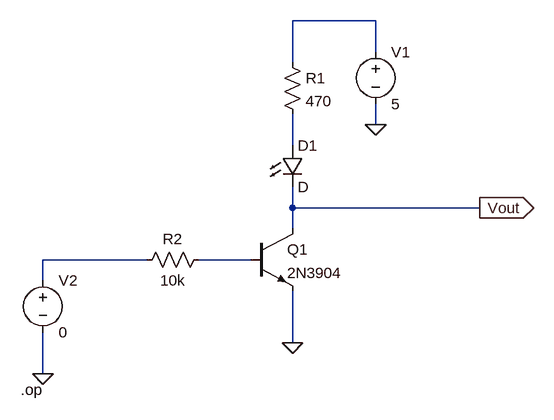
[diagram p0: schematic NotGateAnalog.asc]
NotGateAnalog.asc, the LTspice schematic file:
Version 4
SHEET 1 880 680
WIRE 304 -112 176 -112
WIRE 304 -64 304 -112
WIRE 176 -48 176 -112
WIRE 304 48 304 16
WIRE 176 80 176 32
WIRE 176 176 176 144
WIRE 464 176 176 176
WIRE 176 208 176 176
WIRE -48 256 -208 256
WIRE 112 256 32 256
WIRE -208 288 -208 256
WIRE 176 384 176 304
WIRE -208 432 -208 368
FLAG 304 48 0
FLAG 176 384 0
FLAG 464 176 Vout
IOPIN 464 176 Out
FLAG -208 432 0
SYMBOL npn 112 208 R0
SYMATTR InstName Q1
SYMATTR Value 2N3904
SYMBOL res 160 -64 R0
SYMATTR InstName R1
SYMATTR Value 470
SYMBOL res 48 240 R90
WINDOW 0 0 56 VBottom 2
WINDOW 3 32 56 VTop 2
SYMATTR InstName R2
SYMATTR Value 10k
SYMBOL voltage 304 -80 R0
WINDOW 123 0 0 Left 0
WINDOW 39 0 0 Left 0
SYMATTR InstName V1
SYMATTR Value 5
SYMBOL LED 160 80 R0
SYMATTR InstName D1
SYMBOL voltage -208 272 R0
WINDOW 123 0 0 Left 0
WINDOW 39 0 0 Left 0
SYMATTR InstName V2
SYMATTR Value 0
TEXT -242 456 Left 2 !.op

The netlist it stands for:
* NotGateAnalog.asc
Q1 Vout N004 0 0 2N3904
R1 N001 N002 470
R2 N004 N003 10k
V1 N001 0 5
D1 N002 Vout D
V2 N003 0 0
.model D D
.lib standard.dio
.model NPN NPN
.model PNP PNP
.lib standard.bjt
.op
.backanno
.end